# Altium schematic sheet pca10112_sheet5_misc.SchDoc: Miscellaneous
size A3; Organization: Nordic Semiconductor; DocumentNumber: 4; SheetNumber: 4; SheetTotal: 8; CompanyName: Nordic Semiconductor; ProjectName: pca10112.PrjPCB
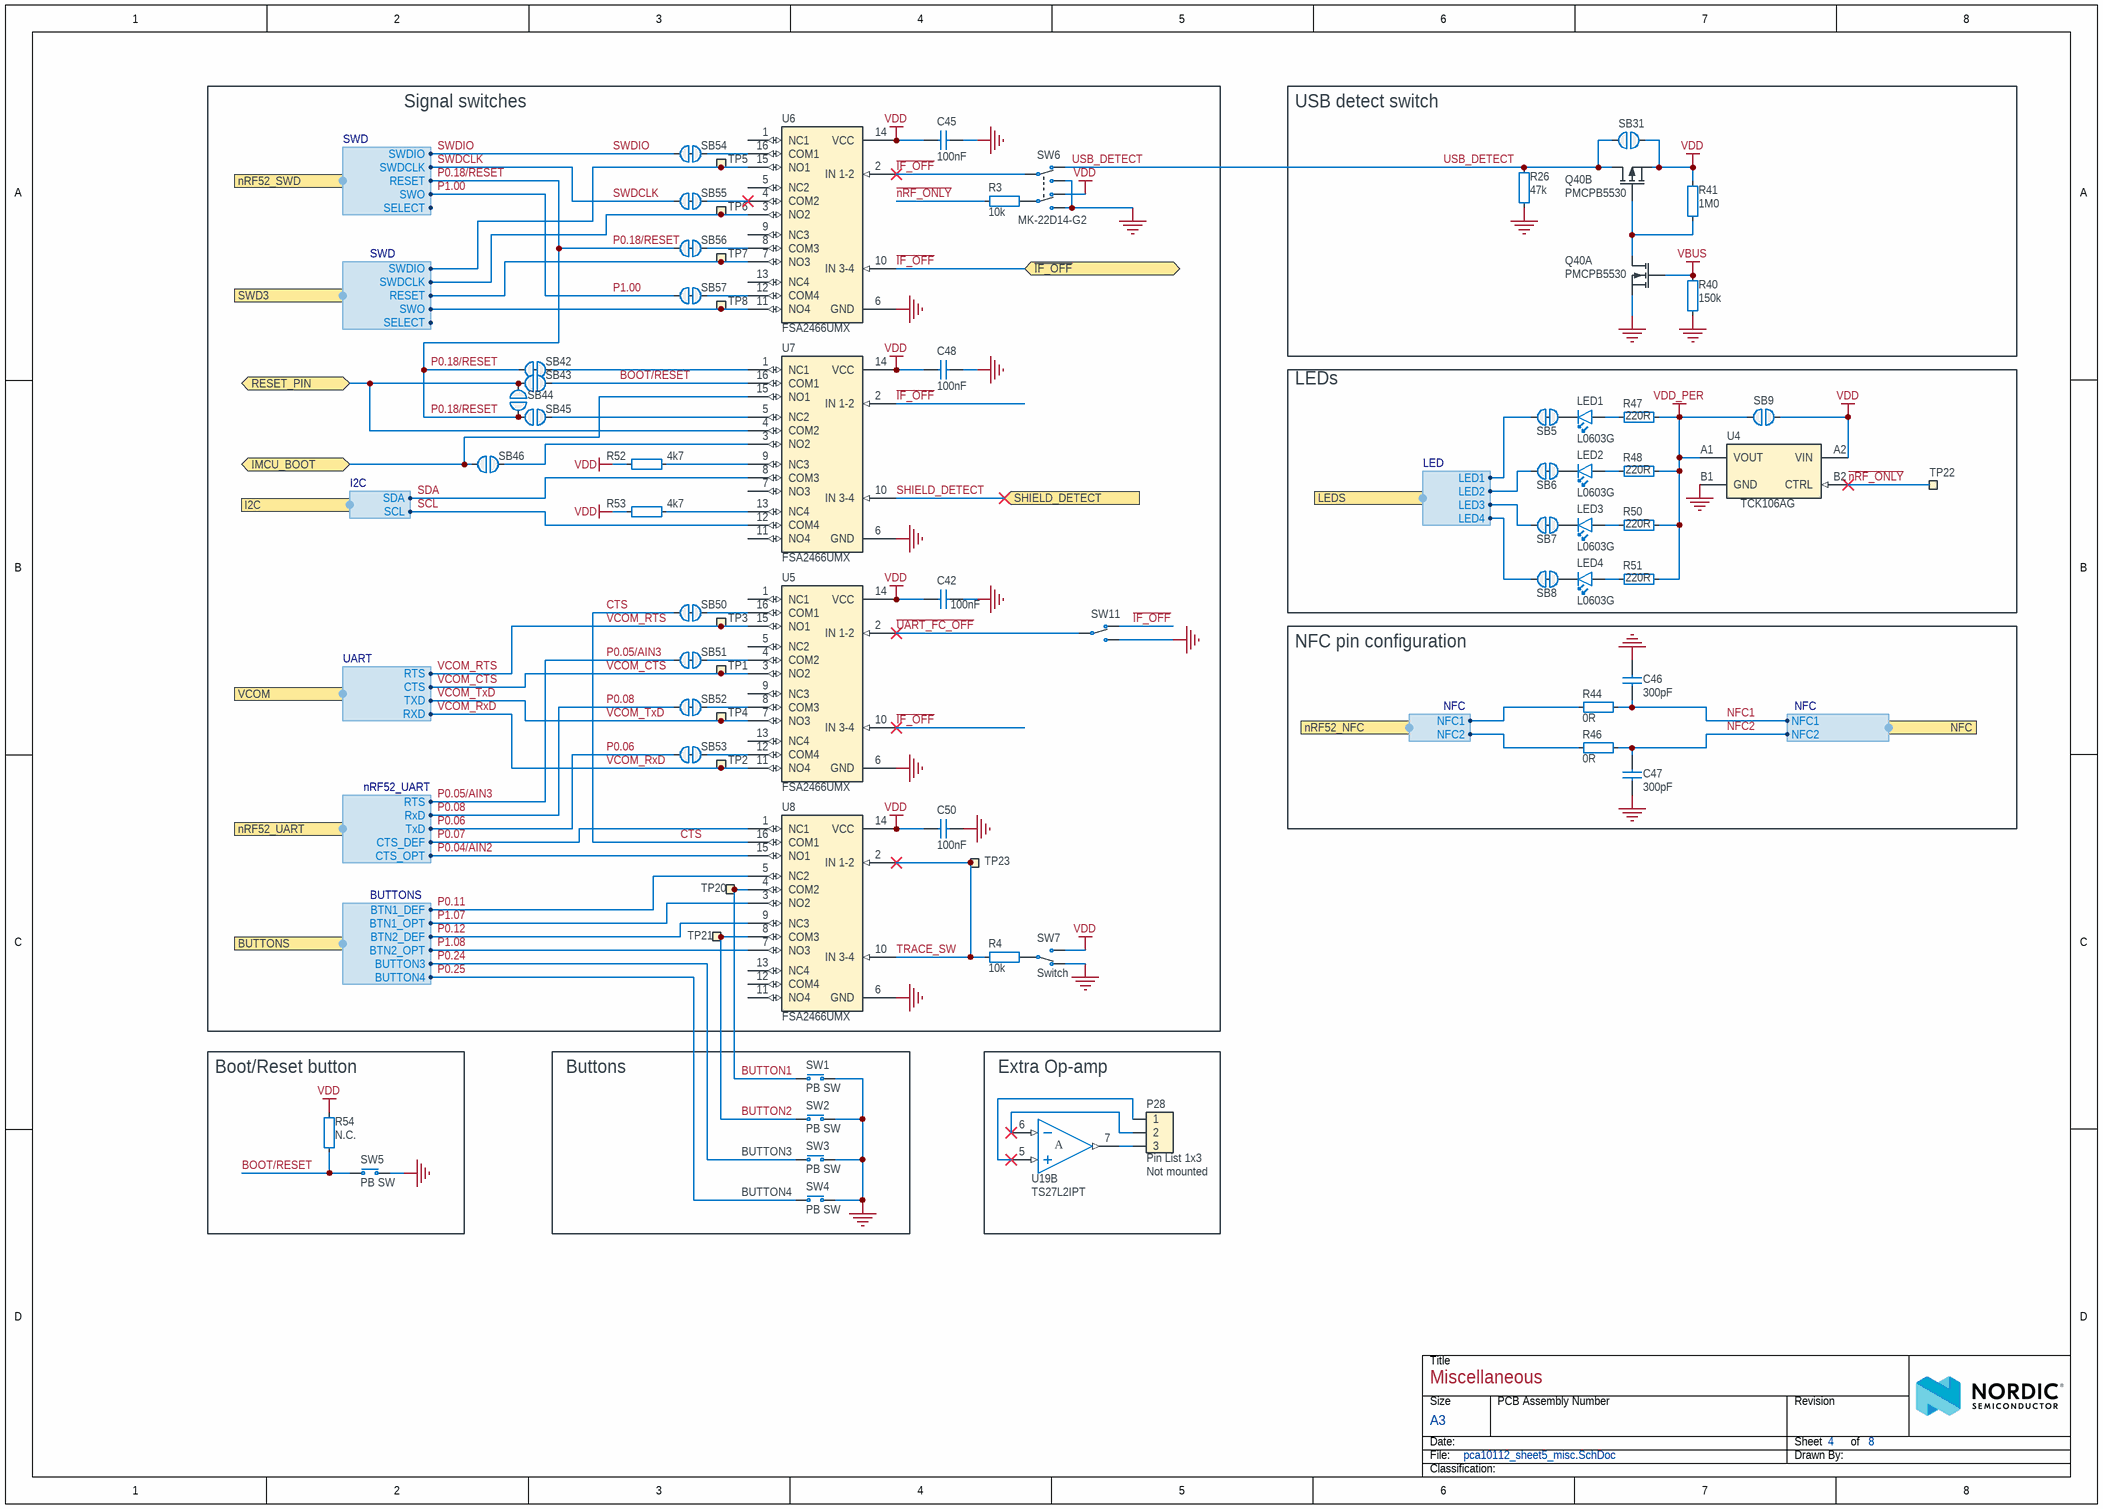
[diagram p0: pca10112_sheet5_misc.SchDoc]

## Parts
C42  100nF  [CAPC0603X03L_C]
C45  100nF  [CAPC0603X03L_C]
C46  300pF  [CAPC1005X04L]
C47  300pF  [CAPC1005X04L]
C48  100nF  [CAPC0603X03L_C]
C50  100nF  [CAPC0603X03L_C]
LED1  L0603G  [LED_0603_G]
LED2  L0603G  [LED_0603_G]
LED3  L0603G  [LED_0603_G]
LED4  L0603G  [LED_0603_G]
P28  Pin List 1x3  Assembly: Not mounted  [LIST_1x3-NC]
Q40  PMCPB5530  [PMCPB5530X]  (parts A,B of 2)
R3  10k  [RESC0603X03L_C]
R4  10k  [RESC0603X03L_C]
R26  47k  [RESC0603X03L_C]
R40  150k  [RESC0603X03L_C]
R41  1M0  [RESC0603X03L_C]
R44  0R  [RESC1005X04L]
R46  0R  [RESC1005X04L]
R47  220R  [RESC0603X03L_C]
R48  220R  [RESC0603X03L_C]
R50  220R  [RESC0603X03L_C]
R51  220R  [RESC0603X03L_C]
R52  4k7  [RESC0603X03L_C]
R53  4k7  [RESC0603X03L_C]
R54  N.C.  [RESC0603X03L_C_NC]
SB5  Solderbridge  [Solderbridge_Shorted]  (value not drawn)  (net tie, no BOM)
SB6  Solderbridge  [Solderbridge_Shorted]  (value not drawn)  (net tie, no BOM)
SB7  Solderbridge  [Solderbridge_Shorted]  (value not drawn)  (net tie, no BOM)
SB8  Solderbridge  [Solderbridge_Shorted]  (value not drawn)  (net tie, no BOM)
SB9  Solderbridge  [Solderbridge]  (value not drawn)  (no BOM)
SB31  Solderbridge  [Solderbridge]  (value not drawn)  (no BOM)
SB42  Solderbridge  [Solderbridge_Shorted]  (value not drawn)  (net tie, no BOM)
SB43  Solderbridge  [Solderbridge]  (value not drawn)  (no BOM)
SB44  Solderbridge  [Solderbridge]  (value not drawn)  (no BOM)
SB45  Solderbridge  [Solderbridge]  (value not drawn)  (no BOM)
SB46  Solderbridge  [Solderbridge]  (value not drawn)  (no BOM)
SB50  Solderbridge  [Solderbridge_Shorted]  (value not drawn)  (net tie, no BOM)
SB51  Solderbridge  [Solderbridge_Shorted]  (value not drawn)  (net tie, no BOM)
SB52  Solderbridge  [Solderbridge_Shorted]  (value not drawn)  (net tie, no BOM)
SB53  Solderbridge  [Solderbridge_Shorted]  (value not drawn)  (net tie, no BOM)
SB54  Solderbridge  [Solderbridge_Shorted]  (value not drawn)  (net tie, no BOM)
SB55  Solderbridge  [Solderbridge_Shorted]  (value not drawn)  (net tie, no BOM)
SB56  Solderbridge  [Solderbridge_Shorted]  (value not drawn)  (net tie, no BOM)
SB57  Solderbridge  [Solderbridge_Shorted]  (value not drawn)  (net tie, no BOM)
SW1  PB SW  [L-KLS7-TS6616B-2.5-160-T]
SW2  PB SW  [L-KLS7-TS6616B-2.5-160-T]
SW3  PB SW  [L-KLS7-TS6616B-2.5-160-T]
SW4  PB SW  [L-KLS7-TS6616B-2.5-160-T]
SW5  PB SW  [L-KLS7-TS6616B-2.5-160-T]
SW6  MK-22D14-G2  [MK-22D14-G2]
SW7  Switch  [CJS-120xA]
SW11  Switch  [CJS-120xA]  (value not drawn)
TP1  Ø1.0mm,SMD  [TP_SMD_D1.0mm]  (value not drawn)  (no BOM)
TP2  Ø1.0mm,SMD  [TP_SMD_D1.0mm]  (value not drawn)  (no BOM)
TP3  Ø1.0mm,SMD  [TP_SMD_D1.0mm]  (value not drawn)  (no BOM)
TP4  Ø1.0mm,SMD  [TP_SMD_D1.0mm]  (value not drawn)  (no BOM)
TP5  Ø1.0mm,SMD  [TP_SMD_D1.0mm]  (value not drawn)  (no BOM)
TP6  Ø1.0mm,SMD  [TP_SMD_D1.0mm]  (value not drawn)  (no BOM)
TP7  Ø1.0mm,SMD  [TP_SMD_D1.0mm]  (value not drawn)  (no BOM)
TP8  Ø1.0mm,SMD  [TP_SMD_D1.0mm]  (value not drawn)  (no BOM)
TP20  Ø1.0mm,SMD  [TP_SMD_D1.0mm]  (value not drawn)  (no BOM)
TP21  Ø1.0mm,SMD  [TP_SMD_D1.0mm]  (value not drawn)  (no BOM)
TP22  Ø1.0mm,SMD  [TP_SMD_D1.0mm]  (value not drawn)  (no BOM)
TP23  Ø1.0mm,SMD  [TP_SMD_D1.0mm]  (value not drawn)  (no BOM)
U4  TCK106AG  [BGA4C40P2X2_76X76X62]
U5  FSA2466UMX  [XQFN40P180X260X50-16N]
U6  FSA2466UMX  [XQFN40P180X260X50-16N]
U7  FSA2466UMX  [XQFN40P180X260X50-16N]
U8  FSA2466UMX  [XQFN40P180X260X50-16N]
U19  TS27L2IPT  [TSOP65P640X120-8N]  (part B of 2)

## Blocks framed on the sheet
Signal switches: C42 C45 C48 C50 R3 R4 R52 R53 SB42-SB46 SB50-SB57 SW6 SW7 SW11 TP1-TP8 TP20 TP21 TP23 U5-U8
USB detect switch: Q40 R26 R40 R41 SB31
LEDs: LED1-LED4 R47 R48 R50 R51 SB5-SB9 TP22 U4
NFC pin configuration: C46 C47 R44 R46
Boot/Reset button: R54 SW5
Buttons: SW1-SW4
Extra Op-amp: P28 U19

## Ports
BUTTONS (harness BUTTONS), I2C (harness I2C), IMCU_BOOT (bidir), LEDS (harness LED), NFC (harness NFC), nRF52_NFC (harness NFC), nRF52_SWD (harness SWD), nRF52_UART (harness nRF52_UART), RESET_PIN (bidir), SHIELD_DETECT (in), SWD3 (harness SWD), VCOM (harness UART), ~{IF_OFF} (bidir)

## Harnesses
LED: LED4, LED3, LED2, LED1
NFC: NFC2, NFC1
BUTTONS: BTN2_OPT, BTN2_DEF, BTN1_OPT, BTN1_DEF, BUTTON3, BUTTON4
nRF52_UART: RTS, CTS_DEF, CTS_OPT, TxD, RxD
SWD: SWDIO, SWDCLK, SWO, RESET, SELECT
UART: RTS, CTS, RXD, TXD
I2C: SCL, SDA

## Nets
GND: C42.1 C45.1 C46.2 C47.1 C48.1 C50.1 Q40.1(S1) R26.2 R40.2 SW1.1(N.O) SW2.1(N.O) SW3.1(N.O) SW4.1(N.O) SW5.1(N.O) SW6.1(N.O-1) SW6.4(N.O-2) SW7.1(N.C) SW11.3(N.O) U4.B1(GND) U5.6(GND) U6.6(GND) U7.6(GND) U8.6(GND)
VBUS: Q40.2(G1) R40.1
VDD: C42.2 C45.2 C48.2 C50.2 Q40.4(S2) R41.1 R52.1 R53.1 R54.2 SB9.1 SB31.1 SW6.6(N.C-2) SW7.3(N.O) U4.A2(VIN) U5.14(VCC) U6.14(VCC) U7.14(VCC) U8.14(VCC)
VDD_PER: R47.2 R48.2 R50.2 R51.2 SB9.2 U4.A1(VOUT)
BOOT/RESET: R54.1 SB43.1 SW5.2(COM) U7.16(COM1)
BUTTON1: SW1.2(COM) TP20.1 U8.4(COM2)
BUTTON2: SW2.2(COM) TP21.1 U8.8(COM3)
CTS: SB50.1 U8.16(COM1)
~{IF_OFF}: SW6.2(COM-1) SW11.1(N.C) U5.10(IN_3-4) U6.2(IN_1-2) U6.10(IN_3-4) U7.2(IN_1-2) ; port ~{IF_OFF}
IMCU_BOOT: SB46.2 U7.15(NO1) ; port IMCU_BOOT
~{nRF_ONLY}: R3.1 TP22.1 U4.B2(CTRL)
NFC1: C46.1 R44.1 ; port NFC.NFC1
NFC2: C47.2 R46.1 ; port NFC.NFC2
P0.04/AIN2: U8.15(NO1) ; port nRF52_UART.CTS_OPT
P0.05/AIN3: SB51.1 ; port nRF52_UART.RTS
P0.06: SB53.1 ; port nRF52_UART.TxD
P0.07: U8.1(NC1) ; port nRF52_UART.CTS_DEF
P0.08: SB52.1 ; port nRF52_UART.RxD
P0.11: U8.5(NC2) ; port BUTTONS.BTN1_DEF
P0.12: U8.9(NC3) ; port BUTTONS.BTN2_DEF
P0.18/RESET: SB42.2 SB44.2 SB45.2 SB56.1 ; port nRF52_SWD.RESET
P0.24: SW3.2(COM) ; port BUTTONS.BUTTON3
P0.25: SW4.2(COM) ; port BUTTONS.BUTTON4
P1.00: SB57.1 ; port nRF52_SWD.SWO
P1.07: U8.3(NO2) ; port BUTTONS.BTN1_OPT
P1.08: U8.7(NO3) ; port BUTTONS.BTN2_OPT
RESET_PIN: SB43.2 SB44.1 U7.4(COM2) ; port RESET_PIN
SCL: U7.12(COM4) ; port I2C.SCL
SDA: U7.8(COM3) ; port I2C.SDA
SHIELD_DETECT: U7.10(IN_3-4) ; port SHIELD_DETECT
SWDCLK: SB55.1 ; port nRF52_SWD.SWDCLK
SWDIO: SB54.1 ; port nRF52_SWD.SWDIO
TRACE_SW: R4.1 TP23.1 U8.2(IN_1-2) U8.10(IN_3-4)
~{UART_FC_OFF}: SW11.2(COM) U5.2(IN_1-2)
USB_DETECT: Q40.3(D2) R26.1 SB31.2 SW6.3(N.C-1)
VCOM_CTS: TP1.1 U5.3(NO2) ; port VCOM.CTS
VCOM_RTS: TP3.1 U5.15(NO1) ; port VCOM.RTS
VCOM_RxD: TP2.1 U5.11(NO4) ; port VCOM.RXD
VCOM_TxD: TP4.1 U5.7(NO3) ; port VCOM.TXD
NetLED1_1: LED1.1(C) SB5.2
NetLED1_2: LED1.2(A) R47.1
NetLED2_1: LED2.1(C) SB6.2
NetLED2_2: LED2.2(A) R48.1
NetLED3_1: LED3.1(C) SB7.2
NetLED3_2: LED3.2(A) R50.1
NetLED4_1: LED4.1(C) SB8.2
NetLED4_2: LED4.2(A) R51.1
NetP28_1: P28.1 U19.5(IN2+)
NetP28_2: P28.2 U19.6(IN2-)
NetP28_3: P28.3 U19.7(OUT2)
NetQ40_5: Q40.5(G2) Q40.6(D1) R41.2
NetR3_2: R3.2 SW6.5(COM-2)
NetR4_2: R4.2 SW7.2(COM)
NetR44_2: R44.2 ; port nRF52_NFC.NFC1
NetR46_2: R46.2 ; port nRF52_NFC.NFC2
NetR52_2: R52.2 U7.9(NC3)
NetR53_2: R53.2 U7.13(NC4)
NetSB5_1: SB5.1 ; port LEDS.LED1
NetSB6_1: SB6.1 ; port LEDS.LED2
NetSB7_1: SB7.1 ; port LEDS.LED3
NetSB8_1: SB8.1 ; port LEDS.LED4
NetSB42_1: SB42.1 U7.1(NC1)
NetSB45_1: SB45.1 U7.5(NC2)
NetSB46_1: SB46.1 U7.3(NO2)
NetSB50_2: SB50.2 U5.16(COM1)
NetSB51_2: SB51.2 U5.4(COM2)
NetSB52_2: SB52.2 U5.8(COM3)
NetSB53_2: SB53.2 U5.12(COM4)
NetSB54_2: SB54.2 U6.16(COM1)
NetSB55_2: SB55.2 U6.4(COM2)
NetSB56_2: SB56.2 U6.8(COM3)
NetSB57_2: SB57.2 U6.12(COM4)
NetTP5_1: TP5.1 U6.15(NO1) ; port SWD3.SWDIO
NetTP6_1: TP6.1 U6.3(NO2) ; port SWD3.SWDCLK
NetTP7_1: TP7.1 U6.7(NO3) ; port SWD3.RESET
NetTP8_1: TP8.1 U6.11(NO4) ; port SWD3.SWO

Not connected (* = marked no-connect by the designer): U5 1(NC1) 5(NC2) 9(NC3) 13(NC4); U6 1(NC1) 5(NC2) 9(NC3) 13(NC4); U7 7(NO3) 11(NO4); U8 11(NO4) 12(COM4) 13(NC4)

## Notes on the sheet
- BUTTON3
- BUTTON4
- Title
- Size
- Date:
- File:
- A3
- PCB Assembly Number
- Sheet         of
- Drawn By:
- Revision
- Classification:
- (in symbol TS27L2IPT, part B) A

## Library data of the parts
C42 C45 C48 C50 = C0201-100n: Capacitor, X5R, ±10%; Manufacturer: N.A.; Part number IPS: 00000001248, 00000002505; Part number Norautron: 262071862; Part number NEMS: 100200078; Note: 16V; Pad Count: 2; Component Status: Active; Part Number: C0201-100n; Manufacturer Part Number: N.A.; Footprint Doc: 0201; LatestRevisionDate: 2017-11-09; Published: 2014-11-13; Value: 100nF; Artikkelnr Noca: N.A.; ComponentLink1URL: N.A.; ComponentLink1Description: Datasheet; ComponentLink2URL: N.A.; ComponentLink2Description: Supplier link; HelpURL: N.A.; Supplier 1: N.A.; Supplier Part Number 1: N.A.; Supplier 2: N.A.; Supplier Part Number 2: N.A.; Component Class: Capacitors; PartId: 100200078; Author: rsk
C46 C47 = C0402-300p: Capacitor, C0G, ±5%, 50V; Manufacturer: N.A.; Part number IPS: 00000007788; Part number NEMS: 100200155; Artikkelnr Noca: 20020004; Pad Count: 2; Component Status: Active; Part Number: C0402-300p; Manufacturer Part Number: N.A.; Footprint Doc: 0402; LatestRevisionDate: 2020-10-13; Published: 2015-05-29; Value: 300pF; Note: 50V; ComponentLink1URL: N.A.; ComponentLink1Description: Datasheet; ComponentLink2URL: N.A.; ComponentLink2Description: Supplier link; HelpURL: N.A.; Supplier 1: Digi-Key; Supplier Part Number 1: 490-3234-1-ND; Supplier 2: N.A.; Supplier Part Number 2: N.A.; Component Class: Capacitors; PartId: 100200155; Author: rsk; Part number Norautron: N.A.
LED1-LED4 = VS 25C7M5: LED, Green, 0603, 573nm, Vf=2.0V, 24mcd, - 40 to +85°C; Manufacturer: Victory Electronics; Part number IPS: 00000001274, 00000009961; Part number Norautron: 26313411; Part number NEMS: 101400097; Note: N.A.; Artikkelnr Noca: 13019193; Pad Count: 2; Component Status: Active; Part Number: VS 25C7M5; Manufacturer Part Number: VS 25C7M5; Footprint Doc: 0603; LatestRevisionDate: 2020-10-23; Published: 2017-08-21; Value: L0603G; ComponentLink1URL: N.A.; ComponentLink1Description: Datasheet; ComponentLink2URL: N.A.; ComponentLink2Description: Supplier link; HelpURL: \\hizz\pro\app9717\Datasheet\optoelectronics\Victory Electronics\VS 25C7M5.pdf; Supplier 1: EC Partner; Supplier Part Number 1: N.A.; Supplier 2: N.A.; Supplier Part Number 2: N.A.; Component Class: Optoelectronics; PartId: 101400097; Author: rsk
P28 = Pin List 1x3, N.C.: Pin List 1x3, 2.54mm (100mil); Manufacturer: N.A.; Part number NEMS: 100500305; Pad Count: 3; Component Status: Active; Part Number: Pin List 1x3, N.C.; Manufacturer Part Number: N.A.; Footprint Doc: LIST_1x3; LatestRevisionDate: 2017-09-07; Published: 2017-09-07; Value: Pin List 1x3; Note: N.A.; Artikkelnr Noca: N.A.; Part number IPS: N.A.; ComponentLink1URL: N.A.; ComponentLink1Description: Datasheet; ComponentLink2URL: N.A.; ComponentLink2Description: Supplier link; HelpURL: N.A.; Supplier 1: N.A.; Supplier Part Number 1: N.A.; Supplier 2: N.A.; Supplier Part Number 2: N.A.; Component Class: Connectors; PartId: 100500305; Author: rsk; Part number Norautron: N.A.
Q40 = PMCPB5530X,115: Mosfet Array N and P-Channel 20V 4A (Ta), 3.4A (Ta) 490mW Surface Mount 6-HUSON-EP (2x2); Manufacturer: Nexperia; Part number IPS: 00000001918; Part number NEMS: 101300165; Note: N.A.; Pad Count: 8; Component Status: Active; Part Number: PMCPB5530X,115; Manufacturer Part Number: PMCPB5530X,115; LatestRevisionDate: 2018-04-30; Published: 2018-04-30; Value: PMCPB5530; Artikkelnr Noca: N.A.; Footprint Doc: 6-UDFN; ComponentLink1URL: https://assets.nexperia.com/documents/data-sheet/PMCPB5530X.pdf; ComponentLink1Description: Datasheet; ComponentLink2URL: https://www.digikey.com/product-detail/en/nexperia-usa-inc/PMCPB5530X115/1727-1327-1-ND/4386339; ComponentLink2Description: Supplier link; HelpURL: https://www.nexperia.com/products/mosfets/small-signal-mosfets/PMCPB5530X.html; Supplier 1: Digi-Key; Supplier Part Number 1: 1727-1327-1-ND; Supplier 2: Mouser; Supplier Part Number 2: 771-PMCPB5530X115; Component Class: Semiconductors; PartId: 101300165; Author: rsk; Part number Norautron: N.A.
R3 R4 = R0201-10k: Resistor, ±1%, 0.05W; Manufacturer: N.A.; Part number IPS: 00000001255; Part number Norautron: 26107101; Part number NEMS: 100100065; Note: Chip Res 1%; Pad Count: 2; Component Status: Active; Part Number: R0201-10k; Manufacturer Part Number: N.A.; Footprint Doc: 0201; LatestRevisionDate: 2014-11-13; Published: 2014-11-13; Value: 10k; Artikkelnr Noca: N.A.; ComponentLink1URL: N.A.; ComponentLink1Description: Datasheet; ComponentLink2URL: N.A.; ComponentLink2Description: Supplier link; HelpURL: N.A.; Supplier 1: N.A.; Supplier Part Number 1: N.A.; Supplier 2: N.A.; Supplier Part Number 2: N.A.; Component Class: Resistors; PartId: 100100065; Author: rsk
R26 = R0201-47k: Resistor, ±1%, 0.05W; Manufacturer: N.A.; Part number IPS: 00000001423; Part number NEMS: 100100076; Note: Chip Res 1%; Pad Count: 2; Component Status: Active; Part Number: R0201-47k; Manufacturer Part Number: N.A.; LatestRevisionDate: 2014-11-13; Published: 2014-11-13; Value: 47k; Artikkelnr Noca: N.A.; Footprint Doc: 0201; ComponentLink1URL: N.A.; ComponentLink1Description: Datasheet; ComponentLink2URL: N.A.; ComponentLink2Description: Supplier link; HelpURL: N.A.; Supplier 1: N.A.; Supplier Part Number 1: N.A.; Supplier 2: N.A.; Supplier Part Number 2: N.A.; Component Class: Resistors; PartId: 100100076; Author: rsk; Part number Norautron: N.A.
R40 = R0201-150k: Resistor, ±1%, 0.05W; Manufacturer: N.A.; Part number IPS: 00000001422; Part number NEMS: 100100082; Note: Chip Res 1%; Pad Count: 2; Component Status: Active; Part Number: R0201-150k; Manufacturer Part Number: N.A.; LatestRevisionDate: 2014-11-13; Published: 2014-11-13; Value: 150k; Artikkelnr Noca: N.A.; Footprint Doc: 0201; ComponentLink1URL: N.A.; ComponentLink1Description: Datasheet; ComponentLink2URL: N.A.; ComponentLink2Description: Supplier link; HelpURL: N.A.; Supplier 1: N.A.; Supplier Part Number 1: N.A.; Supplier 2: N.A.; Supplier Part Number 2: N.A.; Component Class: Resistors; PartId: 100100082; Author: rsk; Part number Norautron: N.A.
R41 = R0201-1M0: Resistor, ±1%, 0.05W; Manufacturer: N.A.; Part number IPS: 00000001418; Part number Norautron: 26107108; Part number NEMS: 100100093; Note: Chip Res 1%; Pad Count: 2; Component Status: Active; Part Number: R0201-1M0; Manufacturer Part Number: N.A.; LatestRevisionDate: 2014-11-13; Published: 2014-11-13; Value: 1M0; Artikkelnr Noca: N.A.; Footprint Doc: 0201; ComponentLink1URL: N.A.; ComponentLink1Description: Datasheet; ComponentLink2URL: N.A.; ComponentLink2Description: Supplier link; HelpURL: N.A.; Supplier 1: N.A.; Supplier Part Number 1: N.A.; Supplier 2: N.A.; Supplier Part Number 2: N.A.; Component Class: Resistors; PartId: 100100093; Author: rsk
R44 R46 = R0402-0R: Resistor, ±5%, 0.063W; Manufacturer: N.A.; Part number IPS: 00000007128; Part number NEMS: 100100109; Note: Chip Res 5%; Artikkelnr Noca: 27049000; Pad Count: 2; Component Status: Active; Part Number: R0402-0R; Manufacturer Part Number: N.A.; Footprint Doc: 0402; LatestRevisionDate: 2009-11-23; Published: 2009-05-08; Value: 0R; ComponentLink1URL: N.A.; ComponentLink1Description: Datasheet; ComponentLink2URL: N.A.; ComponentLink2Description: Supplier link; HelpURL: N.A.; Supplier 1: Farnell; Supplier Part Number 1: 146-9661; Supplier 2: N.A.; Supplier Part Number 2: N.A.; Component Class: Resistors; PartId: 100100109; Author: rsk; Part number Norautron: N.A.
R47 R48 R50 R51 = R0201-220: Resistor, ±1%, 0.05W; Manufacturer: N.A.; Part number IPS: 00000000863; Part number Norautron: 26107014; Part number NEMS: 100100032; Note: Chip Res 1%; Pad Count: 2; Component Status: Active; Part Number: R0201-220; Manufacturer Part Number: N.A.; LatestRevisionDate: 2014-11-13; Published: 2014-11-13; Value: 220R; Artikkelnr Noca: N.A.; Footprint Doc: 0201; ComponentLink1URL: N.A.; ComponentLink1Description: Datasheet; ComponentLink2URL: N.A.; ComponentLink2Description: Supplier link; HelpURL: N.A.; Supplier 1: N.A.; Supplier Part Number 1: N.A.; Supplier 2: N.A.; Supplier Part Number 2: N.A.; Component Class: Resistors; PartId: 100100032; Author: rsk
R52 R53 = R0201-4k7: Resistor, ±1%, 0.05W; Manufacturer: N.A.; Part number IPS: 00000001706; Part number NEMS: 100100061; Note: Chip Res 1%; Pad Count: 2; Component Status: Active; Part Number: R0201-4k7; Manufacturer Part Number: N.A.; Footprint Doc: 0201; LatestRevisionDate: 2014-11-13; Published: 2014-11-13; Value: 4k7; Artikkelnr Noca: N.A.; ComponentLink1URL: N.A.; ComponentLink1Description: Datasheet; ComponentLink2URL: N.A.; ComponentLink2Description: Supplier link; HelpURL: N.A.; Supplier 1: N.A.; Supplier Part Number 1: N.A.; Supplier 2: N.A.; Supplier Part Number 2: N.A.; Component Class: Resistors; PartId: 100100061; Author: rsk; Part number Norautron: N.A.
R54 = R0201-N.C.: Not mounted; Manufacturer: N.A.; Part number NEMS: 100100107; Note: Chip Res; Assembly: Not mounted; Pad Count: 2; Component Status: Active; Part Number: R0201-N.C.; Manufacturer Part Number: N.A.; Footprint Doc: 0201; LatestRevisionDate: 2014-11-13; Published: 2014-11-13; Value: N.C.; Artikkelnr Noca: N.A.; Part number IPS: N.A.; ComponentLink1URL: N.A.; ComponentLink1Description: Datasheet; ComponentLink2URL: N.A.; ComponentLink2Description: Supplier link; HelpURL: N.A.; Supplier 1: N.A.; Supplier Part Number 1: N.A.; Supplier 2: N.A.; Supplier Part Number 2: N.A.; Component Class: Resistors; PartId: 100100107; Author: rsk; Part number Norautron: N.A.
SB5-SB8 SB42 SB50-SB57 = Solderbridge Shorted: Shorted Solderbridge; Manufacturer: N.A.; Part number NEMS: 100500459; Pad Count: 2; Component Status: Active; Part Number: Solderbridge Shorted; Manufacturer Part Number: N.A.; LatestRevisionDate: 2012-08-07; Published: 2012-08-07; Value: Solderbridge; Note: N.A.; Artikkelnr Noca: N.A.; Footprint Doc: Solderbridge_Shorted; Part number IPS: N.A.; ComponentLink1URL: N.A.; ComponentLink1Description: Datasheet; ComponentLink2URL: N.A.; ComponentLink2Description: Supplier link; HelpURL: N.A.; Supplier 1: N.A.; Supplier Part Number 1: N.A.; Supplier 2: N.A.; Supplier Part Number 2: N.A.; Component Class: Connectors; PartId: 100500459; Author: rsk; Part number Norautron: N.A.
SB9 SB31 SB43-SB46 = Solderbridge: Manufacturer: N.A.; Part number NEMS: 100500458; Pad Count: 2; Component Status: Active; Part Number: Solderbridge; Manufacturer Part Number: N.A.; LatestRevisionDate: 2009-12-14; Published: 2009-12-14; Value: Solderbridge; Note: N.A.; Artikkelnr Noca: N.A.; Footprint Doc: Solderbridge; Part number IPS: N.A.; ComponentLink1URL: N.A.; ComponentLink1Description: Datasheet; ComponentLink2URL: N.A.; ComponentLink2Description: Supplier link; HelpURL: N.A.; Supplier 1: N.A.; Supplier Part Number 1: N.A.; Supplier 2: N.A.; Supplier Part Number 2: N.A.; Component Class: Connectors; PartId: 100500458; Author: rsk; Part number Norautron: N.A.
SW1-SW5 = L-KLS7-TS6616B-2.5-160-T: Tactile Switch, SPNO, SMD, 160gf, 6.2x6.4x2.5mm; Manufacturer: KLS; Part number NEMS: 101500133; Note: N.A.; Pad Count: 4; Component Status: Active; Part Number: L-KLS7-TS6616B-2.5-160-T; Manufacturer Part Number: L-KLS7-TS6616B-2.5-160-T; Footprint Doc: L-KLS7-TS6616B-2.5-160-T; LatestRevisionDate: 2021-07-02; Published: 2021-07-02; Value: PB SW; Artikkelnr Noca: N.A.; Part number IPS: N.A.; ComponentLink1URL: N.A.; ComponentLink1Description: Datasheet; ComponentLink2URL: N.A.; ComponentLink2Description: Supplier link; HelpURL: \\hizz\pro\app9717\Datasheet\switches\KLS\L-KLS7-TS6616B-2.5-160-T.pdf; Supplier 1: Cabcon; Supplier Part Number 1: L-KLS7-TS6616B-2.5-160-T; Supplier 2: N.A.; Supplier Part Number 2: N.A.; Component Class: Switches; PartId: 101500133; Author: masi; Part number Norautron: N.A.
SW6 = MK-22D14-G2: Slide Switch DPDT; Manufacturer: HUA-JIE CORP.; Part number NEMS: 101500131; Note: N.A.; Pad Count: 6; Component Status: Active; Part Number: MK-22D14-G2; Manufacturer Part Number: MK-22D14-G2; Footprint Doc: MK-22D14-G2; LatestRevisionDate: 2020-10-06; Published: 2020-12-01; Value: MK-22D14-G2; Artikkelnr Noca: N.A.; Part number IPS: N.A.; ComponentLink1URL: N.A.; ComponentLink1Description: Datasheet; ComponentLink2URL: N.A.; ComponentLink2Description: Supplier link; HelpURL: N.A.; Supplier 1: Cabcon; Supplier Part Number 1: MK-22D14-G2; Supplier 2: N.A.; Supplier Part Number 2: N.A.; Component Class: Switches; PartId: 101500131; Author: rsk; Part number Norautron: N.A.
SW7 = CJS-1200TA: SMD slide Switch (ON-ON); Manufacturer: Copal Electronics Inc; Part number IPS: 00000009982; Part number Norautron: 26030738; Part number NEMS: 101500005; Note: N.A.; Artikkelnr Noca: 50019068; Pad Count: 3; Component Status: Active; Part Number: CJS-1200TA; Manufacturer Part Number: CJS-1200TA; Footprint Doc: CJS-120xA; LatestRevisionDate: 2012-10-03; Published: 2012-10-03; Value: Switch; ComponentLink1URL: N.A.; ComponentLink1Description: Datasheet; ComponentLink2URL: N.A.; ComponentLink2Description: Supplier link; HelpURL: http://media.digikey.com/pdf/Data%20Sheets/COPAL%20Electronics%20PDFs/CJS.pdf; Supplier 1: Digi-Key; Supplier Part Number 1: 563-1021-2-ND; Supplier 2: N.A.; Supplier Part Number 2: N.A.; Component Class: Switches; PartId: 101500005; Author: rsk
SW11 = CJS-1200TA: SMD slide Switch (ON-ON); Manufacturer: Copal Electronics Inc; Part number IPS: 00000009982; Part number Norautron: 26030738; Part number NEMS: 101500005; Pad Count: 3; Note: N.A.; Artikkelnr Noca: 50019068; Component Status: Active; Part Number: CJS-1200TA; PartId: 101500005; Component Class: Switches; Manufacturer Part Number: CJS-1200TA; ComponentLink1URL: N.A.; ComponentLink1Description: Datasheet; ComponentLink2URL: N.A.; ComponentLink2Description: Supplier link; HelpURL: http://media.digikey.com/pdf/Data%20Sheets/COPAL%20Electronics%20PDFs/CJS.pdf; Footprint Doc: CJS-120xA; LatestRevisionDate: 2012-10-03; Published: 2012-10-03; Value: Switch; Supplier 1: Digi-Key; Supplier Part Number 1: 563-1021-2-ND; Supplier 2: N.A.; Supplier Part Number 2: N.A.; Author: rsk
TP1-TP8 TP20-TP23 = TP_SMD_Ø1.0MM: 1.0mm circular SMD testpad; Manufacturer: Nordic Semiconductor; Manufacturer Part Number: N.A.; Part number NEMS: 100500475; Pad Count: 1; Component Status: Active; Part Number: TP_SMD_Ø1.0MM; LatestRevisionDate: 2021-03-05; Published: 2013-06-11; Value: Ø1.0mm,SMD; Note: N.A.; Artikkelnr Noca: N.A.; Footprint Doc: TP_SMD_Ø1.0mm; Part number IPS: N.A.; ComponentLink1URL: N.A.; ComponentLink1Description: Datasheet; ComponentLink2URL: N.A.; ComponentLink2Description: Supplier link; HelpURL: N.A.; Supplier 1: N.A.; Supplier Part Number 1: N.A.; Supplier 2: N.A.; Supplier Part Number 2: N.A.; Component Class: Connectors; PartId: 100500475; Author: rsk; Part number Norautron: N.A.
U4 = TCK106AG: 1.0 A Load Switch IC with Slew Rate Control Driver in Ultra Small Package; Manufacturer: Toshiba; Manufacturer Part Number: TCK106AG,LF; Part number IPS: 00000004390; Part number Norautron: 26500627; Part number NEMS: 101900575; Note: N.A.; Pad Count: 4; Component Status: Active; Part Number: TCK106AG; Footprint Doc: WLCSP-4; LatestRevisionDate: 2019-03-01; Published: 2019-02-17; Value: TCK106AG; Artikkelnr Noca: N.A.; ComponentLink1URL: https://toshiba.semicon-storage.com/info/docget.jsp?did=30131&prodName=TCK106AG; ComponentLink1Description: Datasheet; ComponentLink2URL: N.A.; ComponentLink2Description: Supplier link; HelpURL: N.A.; Supplier 1: Digi-Key; Supplier Part Number 1: TCK106AGLFTR-ND; Supplier 2: Mouser; Supplier Part Number 2: 757-TCK106AGLF; Component Class: Misc_ICs; PartId: 101900575; Author: rsk
U5-U8 = FSA2466UMX: Data / Audio Low-Voltage Dual DPDT Analog Switch; Manufacturer: ON Semiconductor; Part number IPS: 00000009986; Part number Norautron: 26500608; Part number NEMS: 101900422; Note: N.A.; Artikkelnr Noca: 15070069; Pad Count: 16; Component Status: Active; Part Number: FSA2466UMX; Manufacturer Part Number: FSA2466UMX; Footprint Doc: UFQFN-16; LatestRevisionDate: 2019-05-15; Published: 2016-05-18; Value: FSA2466UMX; ComponentLink1URL: N.A.; ComponentLink1Description: Datasheet; ComponentLink2URL: N.A.; ComponentLink2Description: Supplier link; HelpURL: https://www.onsemi.com/pub/Collateral/FSA2466-D.PDF; Supplier 1: Digi-Key; Supplier Part Number 1: FSA2466UMXCT-ND; Supplier 2: Mouser; Supplier Part Number 2: 512-FSA2466UMX; Component Class: Misc_ICs; PartId: 101900422; Author: rsk
U19 = TS27L2IPT: Precision very low power CMOS dual operational amplifier; Manufacturer: STMicroelectronics; Part number IPS: 00000009991; Part number NEMS: 101900442; Note: N.A.; Artikkelnr Noca: 17010019; Pad Count: 8; Component Status: Active; Part Number: TS27L2IPT; Manufacturer Part Number: TS27L2IPT; Footprint Doc: TSSOP-8; LatestRevisionDate: 2016-07-07; Published: 2016-07-07; Value: TS27L2IPT; ComponentLink1URL: N.A.; ComponentLink1Description: Datasheet; ComponentLink2URL: N.A.; ComponentLink2Description: Supplier link; HelpURL: http://www.st.com/content/ccc/resource/technical/document/datasheet/38/5b/ca/bd/c0/26/4a/34/CD00000880.pdf/files/CD00000880.pdf/jcr:content/translations/en.CD00000880.pdf; Supplier 1: Digi-Key; Supplier Part Number 1: 497-8085-1-ND; Supplier 2: N.A.; Supplier Part Number 2: N.A.; Component Class: Misc_ICs; PartId: 101900442; Author: rsk; Part number Norautron: N.A.